# Altium schematic sheet 5V_LS.SchDoc
size A4
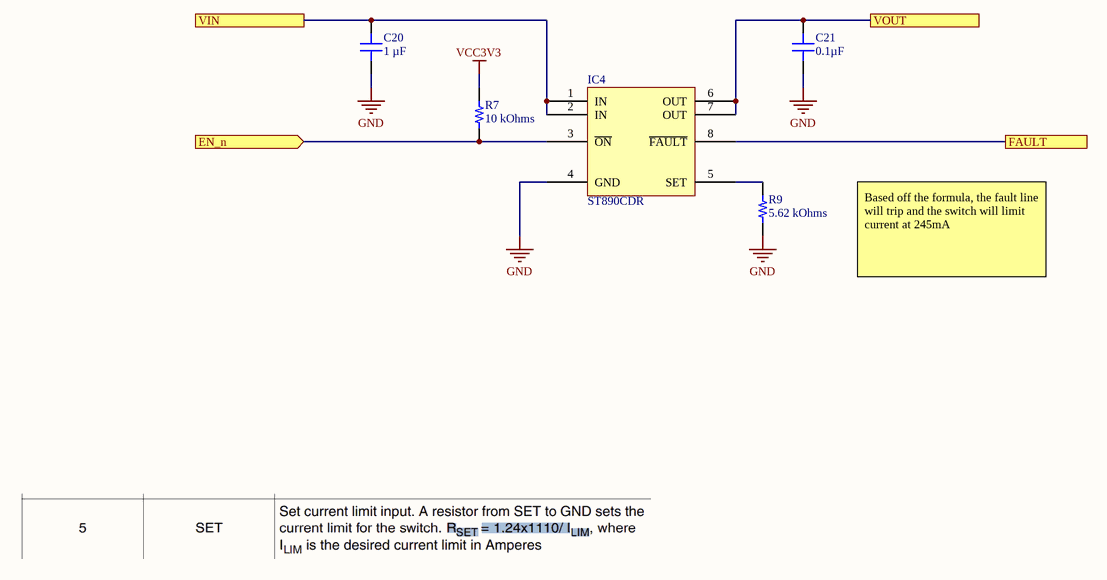
[diagram p0: 5V_LS.SchDoc]

## Parts
C20  1 µF  [CAP 0402_1005]
C21  0.1µF  [CAP 0402_1005]
IC4  ST890CDR  [ST SOIC-8N]
R7  10 kOhms  [RES 0402_1005]
R9  5.62 kOhms  [RES 0402_1005]

## Ports
EN_n (in), FAULT, VIN, VOUT

## Nets
GND: C20.1 C21.1 IC4.4(GND) R9.1
VCC3V3: R7.2
EN_n: IC4.3(~{ON}) R7.1 ; port EN_n
FAULT: IC4.8(~{FAULT}) ; port FAULT
VIN: C20.2 IC4.1(IN) IC4.2(IN) ; port VIN
VOUT: C21.2 IC4.6(OUT) IC4.7(OUT) ; port VOUT
NetIC4_5: IC4.5(SET) R9.2

## Notes on the sheet
- Based off the formula, the fault line will trip and the switch will limit current at 245mA

## Library data of the parts
C20 = GRM155C71A105KE11D: CAP CER 1UF 10V X7S 0402; manufacturer: Murata Electronics; Tolerance: ±10%; Part Number: GRM155C71A105KE11D; Value: 1 µF; Applications: General Purpose; Capacitance: 1 µF; componentlink1description: Datasheet; componentlink1url: https://search.murata.co.jp/Ceramy/image/img/A01X/G101/ENG/GRM155C71A105KE11-01.pdf; componentlink2description: DigiKey Link; componentlink2url: https://www.digikey.com/en/products/detail/murata-electronics/GRM155C71A105KE11D/6606086; Device Package: 0402 (1005 Metric); lastupdated: 2023-06-04 7:05:15 PM; Lifecycle Status: Active; Minimum Order: 1; Mounting Type: Surface Mount, MLCC; Operating Temperature: -55°C ~ 125°C; Package / Case: 0402 (1005 Metric); packaging: TapeAndReel; partid: 1749; Part Status: Active; price: 0.01; series: GRM; Size / Dimension: 0.039" L x 0.020" W (1.00mm x 0.50mm); Supplier 1: DigiKey; Supplier Part Number 1: 490-14457-1-ND; Temperature Coefficient: X7S; Thickness (Max): 0.024" (0.60mm); Voltage - Rated: 10V
C21 = 0402ZC104KAT2A: CAP CER 0.1UF 10V X7R 0402; manufacturer: AVX Corporation; Tolerance: ±10%; Part Number: 0402ZC104KAT2A; Value: 0.1µF; Applications: General Purpose; Capacitance: 0.1µF; componentlink1description: Datasheet; componentlink1url: http://datasheets.avx.com/X7RDielectric.pdf; componentlink2description: DigiKey Link; componentlink2url: http://digikey.com/product-detail/en/avx-corporation/0402ZC104KAT2A/478-7891-1-ND/3881514; Device Package: 0402 (1005 Metric); lastupdated: 2022-02-08 12:26:59 PM; Lifecycle Status: Active; Minimum Order: 1; Mounting Type: Surface Mount, MLCC; Operating Temperature: -55°C ~ 125°C; Package / Case: 0402 (1005 Metric); packaging: TapeAndReel; partid: 1757; Part Status: Active; price: 0.09; series: -; Size / Dimension: 0.039" L x 0.020" W (1.00mm x 0.50mm); Supplier 1: DigiKey; Supplier Part Number 1: 478-7891-1-ND; Temperature Coefficient: X7R; Thickness (Max): 0.022" (0.55mm); Voltage - Rated: 10V
IC4 = ST890CDR: IC PWR SWITCH P-CHANNEL 1:1 8SO; Manufacturer: STMicroelectronics; Current - Output (Max): 1.2A; Fault Protection: Current Limiting (Adjustable), Over Temperature; Input Type: Non-Inverting; Interface: On/Off; Number of Outputs: 1; Output Configuration: High Side; Rds On (Typ): 75mOhm; Switch Type: General Purpose; Voltage - Load: 2.7V ~ 5.5V; Voltage - Supply (Vcc/Vdd): Not Required; Part Number: ST890CDR; ComponentLink1Description: Datasheet; ComponentLink1URL: http://www.st.com/content/ccc/resource/technical/document/datasheet/1a/8c/51/d8/96/28/4d/63/CD00002878.pdf/files/CD00002878.pdf/jcr:content/translations/en.CD00002878.pdf; ComponentLink2Description: DigiKey Link; ComponentLink2URL: http://digikey.com/product-detail/en/stmicroelectronics/ST890CDR/497-6543-1-ND/1865325; Device Package: 8-SOIC (0.154", 3.90mm Width); LastUpdated: 2020-05-24 9:33:45 PM; Lifecycle Status: Active; Minimum Order: 1; Mounting Type: Surface Mount; Operating Temperature: -40°C ~ 85°C (TA); Output Type: P-Channel; Package / Case: 8-SOIC (0.154", 3.90mm Width); Packaging: TapeAndReel; Part Status: Active; Price: 0.47; Ratio - Input:Output: 1:1; Series: -; Supplier 1: DigiKey; Supplier Part Number 1: 497-6543-1-ND; Supplier Device Package: 8-SO
R7 = RP73PF1E10KBTD: RES 10K OHM 0.1% 1/10W 0402; Manufacturer: TE Connectivity Passive Product; Power (Watts): 0.1W, 1/10W; Temperature Coefficient: ±25ppm/°C; Part Number: RP73PF1E10KBTD; Value: 10 kOhms; ComponentLink1Description: Datasheet; ComponentLink1URL: https://www.te.com/commerce/DocumentDelivery/DDEController?Action=srchrtrv&DocNm=1773272&DocType=DS&DocLang=English; ComponentLink2Description: DigiKey Link; ComponentLink2URL: https://www.digikey.com/en/products/detail/te-connectivity-passive-product/RP73PF1E10KBTD/8260957; Composition: Thin Film; Device Package: 0402 (1005 Metric); Height - Seated (Max): 0.014" (0.35mm); LastUpdated: 2023-06-04 7:27:27 PM; Lifecycle Status: Active; Minimum Order: 1; Number of Terminations: 2; Operating Temperature: -55°C ~ 155°C; Package / Case: 0402 (1005 Metric); Packaging: TapeAndReel; PartId: 2434; Part Status: Active; Price: 0.08; Resistance: 10 kOhms; Series: RP73, Holsworthy; Size / Dimension: 0.039" L x 0.020" W (1.00mm x 0.50mm); Supplier 1: DigiKey; Supplier Part Number 1: A127415CT-ND; Supplier Device Package: 0402; Tolerance: ±0.1%
R9 = RP73PF1E5K62BTD: RES 5.62K OHM 0.1% 1/10W 0402; Manufacturer: TE Connectivity Passive Product; Power (Watts): 0.1W, 1/10W; Temperature Coefficient: ±25ppm/°C; Part Number: RP73PF1E5K62BTD; Value: 5.62 kOhms; ComponentLink1Description: Datasheet; ComponentLink1URL: https://www.te.com/commerce/DocumentDelivery/DDEController?Action=srchrtrv&DocNm=1773272&DocType=DS&DocLang=English; ComponentLink2Description: DigiKey Link; ComponentLink2URL: https://www.digikey.com/en/products/detail/te-connectivity-passive-product/RP73PF1E5K62BTD/8260933; Composition: Thin Film; Device Package: 0402 (1005 Metric); Height - Seated (Max): 0.014" (0.35mm); LastUpdated: 2023-06-04 7:27:27 PM; Lifecycle Status: Active; Minimum Order: 1; Number of Terminations: 2; Operating Temperature: -55°C ~ 155°C; Package / Case: 0402 (1005 Metric); Packaging: TapeAndReel; PartId: 2425; Part Status: Active; Price: 0.08; Resistance: 5.62 kOhms; Series: RP73, Holsworthy; Size / Dimension: 0.039" L x 0.020" W (1.00mm x 0.50mm); Supplier 1: DigiKey; Supplier Part Number 1: A127391CT-ND; Supplier Device Package: 0402; Tolerance: ±0.1%